# EAGLE design MPL3115A2_breakout (EAGLE 6.3)
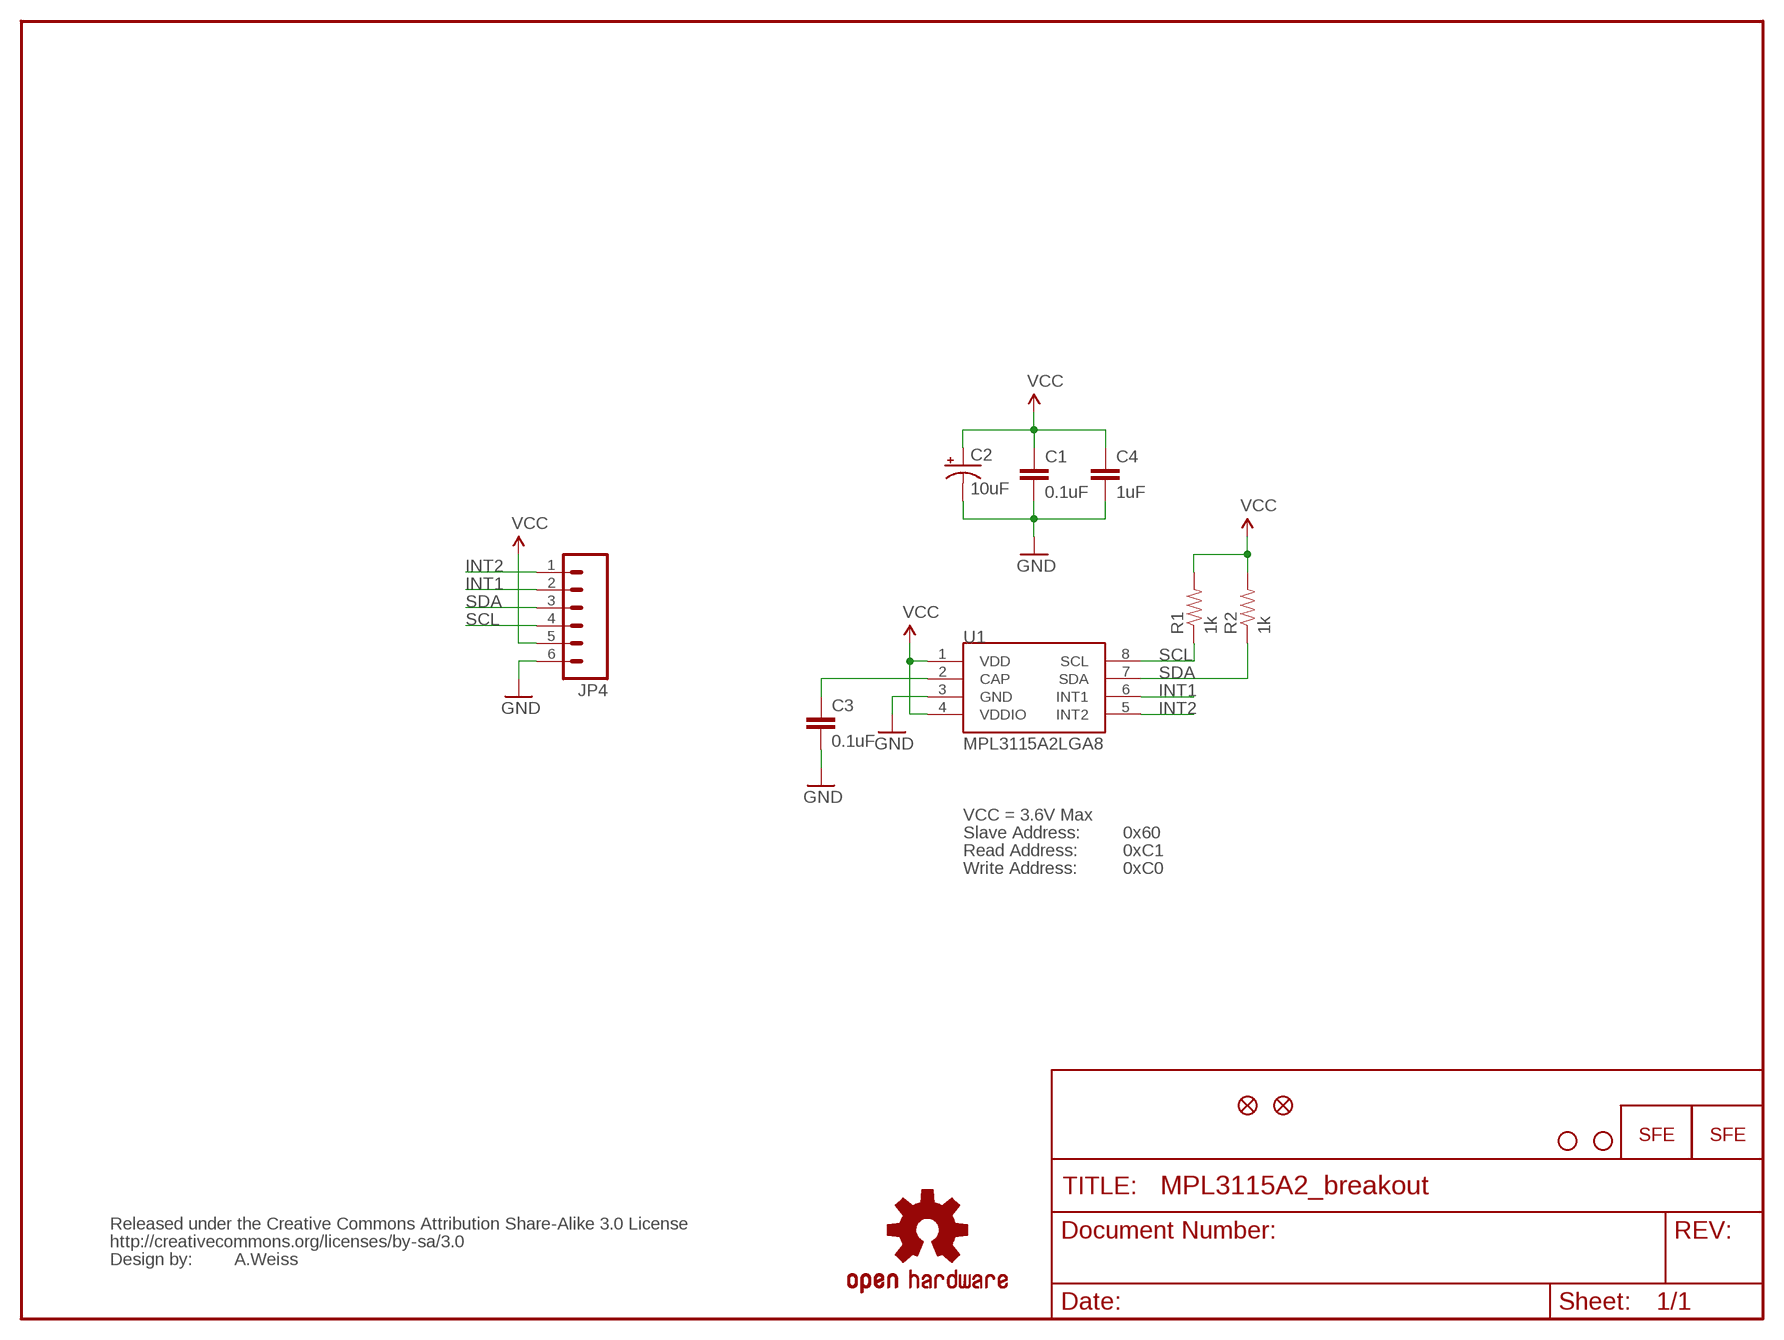
[diagram p0: schematic, sheet 1]

## Parts
C1  0.1uF  CAP0402-CAP  [0402-CAP]
C2  10uF  CAP_POL1206  [EIA3216]
C3  0.1uF  CAP0402-CAP  [0402-CAP]
C4  1uF  CAP0402-CAP  [0402-CAP]
JP1  LOGO-SFESK  [SFE-LOGO-FLAME]
JP2  STAND-OFF  [STAND-OFF]
JP3  STAND-OFF  [STAND-OFF]
JP4  M06SIP  [1X06]
JP5  LOGO-SFESK  [SFE-LOGO-FLAME]
JP6  FIDUCIALUFIDUCIAL  [MICRO-FIDUCIAL]
JP7  FIDUCIALUFIDUCIAL  [MICRO-FIDUCIAL]
R1  1k  RESISTOR0402-RES  [0402-RES]
R2  1k  RESISTOR0402-RES  [0402-RES]
U1  MPL3115A2LGA8  [LGA8]
U$1  OSHW-LOGOS  [OSHW-LOGO-S]
U$2  CREATIVE_COMMONS  [CREATIVE_COMMONS]

## Nets
GND: C1.2 C2.C(-) C3.2 C4.2 JP4.6 U1.3(GND)
INT1: JP4.2 U1.6(INT1)
INT2: JP4.1 U1.5(INT2)
N$3: C3.1 U1.2(CAP)
SCL: JP4.4 R1.1 U1.8(SCL)
SDA: JP4.3 R2.1 U1.7(SDA)
VCC: C1.1 C2.A(+) C4.1 JP4.5 R1.2 R2.2 U1.1(VDD) U1.4(VDDIO)

## Notes on the sheet
- VCC = 3.6V Max
- Slave Address: | 0x60
- Read Address: | 0xC1
- Write Address: | 0xC0
- A.Weiss

## Library data of the parts
C1 C3 C4 = SparkFun:CAP: Capacitor Standard 0603 ceramic capacitor, and 0.1" leaded capacitor.
C2 = SparkFun:CAP_POL: Capacitor Polarized These are standard SMD and PTH capacitors. Normally 10uF, 47uF, and 100uF in electrolytic and tantalum varieties. Always verify the external diameter of the through hole cap, it varies with capacity, voltage, and manufacturer. The EIA devices should be standard.
JP1 JP5 = SparkFun:LOGO-SFE: Spark Fun Electronics PCB Logo This is the standard Spark Fun Electronics PCB logo.
JP2 JP3 = SparkFun:STAND-OFF: Stand Off This is the mechanical footprint for a #4 phillips button head screw. Use the keepout ring to avoid running the screw head into surrounding components. SKU : PRT-00447
JP4 = SparkFun:M06: Header 6 Standard 6-pin 0.1" header. Use with straight break away headers (SKU : PRT-00116), right angle break away headers (PRT-00553), swiss pins (PRT-00743), machine pins (PRT-00117), and female headers (PRT-00115). Molex polarized connector foot print use with SKU : PRT-08094 with associated crimp pins and housings. NOTES ON THE VARIANTS LOCK and LOCK_LONGPADS... This footprint was designed to help hold the alignment of a through-hole component (i.e. 6-pin header) while soldering it into place. You may notice that each hole has been shifted either up or down by 0.005 of an inch from it's more standard position (which is a perfectly straight line). This slight alteration caused the pins (the squares in the middle) to touch the edges of the holes. Because they are alternating, it causes a "brace" to hold the component in place. 0.005 has proven to be the perfect amount of "off-center" position when using our standard breakaway headers. Although looks a little odd when you look at the bare footprint, once you have a header in there, the alteration is very hard to notice. Also, if you push a header all the way into place, it is covered up entirely on the bottom side. This idea of altering the position of holes to aid alignment will be further integrated into the Sparkfun Library for other footprints. It can help hold any component with 3 or more connection pins.
JP6 JP7 = SparkFun:FIDUCIAL: Fiducial Alignment Points Various fiducial points for machine vision alignment.
R1 R2 = SparkFun:RESISTOR: Resistor Basic schematic elements and footprints for 0603, 1206, and PTH resistors.
U1 = SparkFun-Sensors:MPL3115A2: Altimeter/Pressure Sensor, I2C, 1.95V-3.6V supply, 50 to 110kPa
U$1 = SparkFun:OSHW-LOGO: Open Source Hardware Logo This logo indicates the piece of hardware it is found on incorporates a OSHW license and/or adheres to the definition of open source hardware found here: http://freedomdefined.org/OSHW
U$2 = SparkFun:CREATIVE_COMMONS

## Board
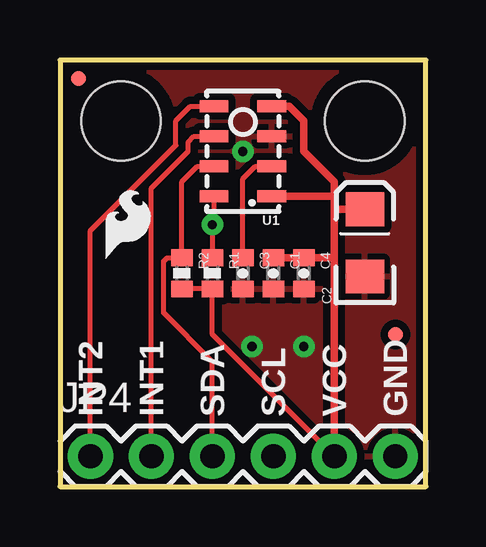
[diagram p1: board, top side]
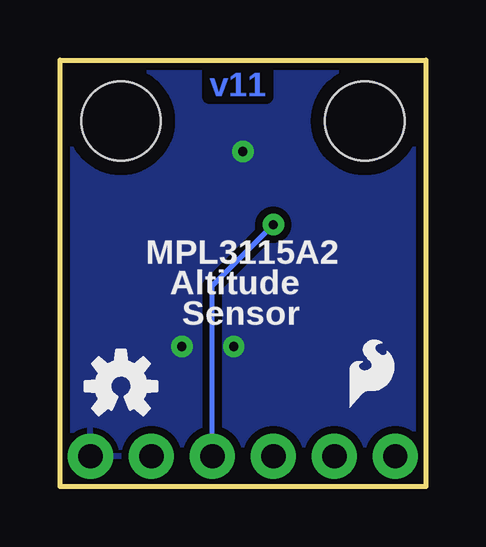
[diagram p2: board, bottom side, seen from below]

Size 15.24 x 17.78 mm. Coordinates in mm from the lower left corner, seen from the top.
Outline: 15.24,17.78 0,17.78 0,0 15.24,0 15.24,17.78
Copper layers (1*16): Top 0.0356mm / dielectric 1.5011mm / Bottom 0.0356mm
Design rules "default": minimum track width 8mil, minimum drill 15mil, track to track 8mil, track to pad 8mil, pad to pad 8mil, via to via 8mil, smd to smd 8mil, copper to edge 10mil, drill to drill 8mil, minimum pad ring 12mil, minimum via ring 10mil, stop-mask expansion 4mil, vias tented up to drill 20mil, thermal gap 10mil

### Footprints (pad centres in the part's own frame; a part is rotated, then mirrored left to right if it is on the bottom)
0402-CAP = smd 0.7 x 0.9: 1 -0.65,0; 2 0.65,0
EIA3216 = smd 1.4 x 1.6: A 1.4,0; C -1.4,0
STAND-OFF = hole 3.302: 0,0
1X06 = drill 1.016 pad 1.88: 1 0,0; 2 2.54,0; 3 5.08,0; 4 7.62,0; 5 10.16,0; 6 12.7,0
MICRO-FIDUCIAL = smd 0.635 x 0.635: 1 0,0
0402-RES = smd 0.7 x 0.9: 1 -0.65,0; 2 0.65,0
LGA8 = smd 1.2 x 0.5: 1 -1.2,1.875; 2 -1.2,0.625; 3 -1.2,-0.625; 4 -1.2,-1.875; 5 1.2,-1.875; 6 1.2,-0.625; 7 1.2,0.625; 8 1.2,1.875

### Placement (x,y rotation side)
C1  8.89,8.89 270 top
C2  12.7,10.16 90 top
C3  7.62,8.89 270 top
C4  10.16,8.89 270 top
JP1  3.17,3.3 0 bottom
JP2  12.7,15.24 180 top
JP3  2.54,15.24 180 top
JP4  1.27,1.27 0 top
JP5  1.91,9.53 0 top
JP6  13.97,6.35 0 top
JP7  0.76,17.02 0 top
R1  6.35,8.89 270 top
R2  5.08,8.89 270 top
U1  7.62,13.97 180 top
U$1  12.7,4.19 0 bottom
U$2  16.51,-10.16 0 top  (outside the outline)

### Tracks (layer width: path | path; a pad name or v marks a point on that pad's centre or on a via)
GND  (via drill 0.38)
  other vias: 7.62,13.97 10.16,5.84 8,5.84
  pour Bottom (isolate 0.305): 15.24,0 15.24,17.78 0,17.78 0,0
  pour Top (isolate 0.305): 15.24,0 15.24,17.78 0,17.78 0,0
INT1
  Top 0.203: U1.6 5.58,14.6 5.33,14.35 5.33,13.97 3.81,12.45 JP4.2
INT2
  Top 0.203: U1.5 5.43,15.85 4.83,15.24 4.83,14.22 1.27,10.67 JP4.1
N$3
  Top 0.203: U1.2 8.14,13.35 7.62,12.83 C3.1
SCL  (via drill 0.38)
  Top 0.203: U1.8 6.42,10.99 v6.35,10.92 R1.1
  Bottom 0.203: JP4.4 8.89,8.38 v6.35,10.92
SDA
  Top 0.203: U1.7 5.72,13.35 5.08,12.7 R2.1 4.46,9.54 4.32,9.4 4.32,7.24 6.35,5.21 JP4.3
VCC
  Top 0.203: R2.2 R1.2 6.35,6.35 JP4.5
  Top 0.305: 11.43,12.06 11.43,12.7 10.16,13.97 10.16,15.24 9.55,15.85 U1.4 | 11.43,11.68 11.43,12.06 | 11.43,9.53 11.43,11.68 | JP4.5 11.43,9.53 | U1.1 11.4,12.1 11.43,12.06 | C2.A 11.55,11.56 11.43,11.68 | C1.1 C4.1 11.41,9.54 11.43,9.53

### Text on the board
Bottom: v11
tPlace: INT2 | INT1 | SDA | SCL | VCC | GND
bPlace: MPL3115A2 | Altitude | Sensor